# Altium schematic sheet FPGA_165B_Repeat_DigitalIO.SchDoc
size A; Organization: Altium Limited; Address1: L3, 12a Rodborough Rd; Address2: Frenchs Forest; Address3: NSW; Address4: Australia 2086; DocumentNumber: 1; SheetNumber: 1; SheetTotal: 2
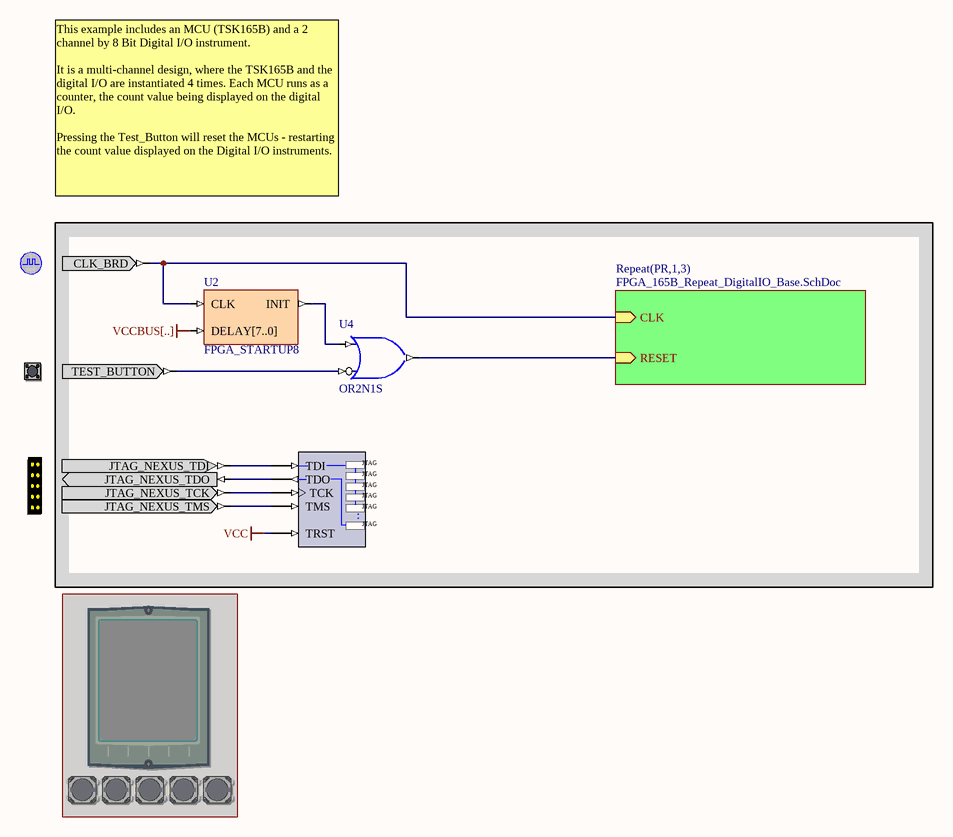
[diagram p0: FPGA_165B_Repeat_DigitalIO.SchDoc]

## Parts
(Parts that share a designator on the sheet are numbered #1, #2 ... from top to bottom, then left to right.)
?#1  CLOCK_BOARD  (value not drawn)
?#2  TEST_BUTTON  (value not drawn)
?#3  NEXUS_JTAG_CONNECTOR  (value not drawn)
?#4  FIRMWARE_TFT_ENABLE  (value not drawn)  (masked out: inside a compile mask, not in the netlist)
?#5  FIRMWARE_BUTTONS_ENABLE  (value not drawn)  (masked out: inside a compile mask, not in the netlist)
NEXUS_JTAG_PORT  NEXUS_JTAG_PORT  (value not drawn)
U2  FPGA_STARTUP8
U4  OR2N1S

## Sub-sheets
Repeat(PR,1,3) = FPGA_165B_Repeat_DigitalIO_Base.SchDoc: CLK (in), RESET (in)

## Nets
VCC: NEXUS_JTAG_PORT.TRST
VCCBUS[..]: U2.DELAY[7..0]
Net?#1_CLK_BRD: ?#1.CLK_BRD U2.CLK ; sheet Repeat(PR,1,3)/CLK
Net?#2_TEST_BUTTON: ?#2.TEST_BUTTON U4.I0
Net?#3_JTAG_NEXUS_TCK: ?#3.JTAG_NEXUS_TCK NEXUS_JTAG_PORT.TCK
Net?#3_JTAG_NEXUS_TDI: ?#3.JTAG_NEXUS_TDI NEXUS_JTAG_PORT.TDI
Net?#3_JTAG_NEXUS_TDO: ?#3.JTAG_NEXUS_TDO NEXUS_JTAG_PORT.TDO
Net?#3_JTAG_NEXUS_TMS: ?#3.JTAG_NEXUS_TMS NEXUS_JTAG_PORT.TMS
NetU2_INIT: U2.INIT U4.I1
NetU4_O: U4.O ; sheet Repeat(PR,1,3)/RESET

## Notes on the sheet
- This example includes an MCU (TSK165B) and a 2 channel by 8 Bit Digital I/O instrument.
  It is a multi-channel design, where the TSK165B and the digital I/O are instantiated 4 times. Each MCU runs as a counter, the count value being displayed on the digital I/O.
  Pressing the Test_Button will reset the MCUs - restarting the count value displayed on the Digital I/O instruments.
- Title
- Size:
- Date:
- A
- Number:
- Time:
- Revision:
- Sheet
- of
- File:
- (in symbol NEXUS_JTAG_PORT) JTAG; .

## Library data of the parts
?#1 = CLOCK_BOARD: Global System Clock Supply; PortComponent: True; Published: 19-Nov-2003; Publisher: Altium Limited; HelpURL: TR0143 Technical Reference Manual for Altium's Desktop NanoBoard NB2DSK01.pdf#page=41; UseInDSF: True
?#2 = TEST_BUTTON: Test / Reset Button; PortComponent: True; Published: 19-Nov-2003; Publisher: Altium Limited; HelpURL: TR0143 Technical Reference Manual for Altium's Desktop NanoBoard NB2DSK01.pdf#page=53
?#3 = NEXUS_JTAG_CONNECTOR: JTAG Port; PortComponent: True; Published: 19-Nov-2003; Publisher: Altium Limited; HelpURL: TR0102 NanoBoard Technical Reference Manual - NB1.pdf#page=33
?#4 = FIRMWARE_TFT_ENABLE: TFT LCD Panel; PortComponent: True; Published: 22-Jan-2007; Publisher: Altium Limited; HelpURL: TR0143 Technical Reference Manual for Altium's Desktop NanoBoard NB2DSK01.pdf#page=50
?#5 = FIRMWARE_BUTTONS_ENABLE: Generic User Buttons; PortComponent: True; Published: 16-Apr-2007; Publisher: Altium Limited; HelpURL: TR0143 Technical Reference Manual for Altium's Desktop NanoBoard NB2DSK01.pdf#page=53
NEXUS_JTAG_PORT = NEXUS_JTAG_PORT: Soft Nexus-Chain Connector; NEXUS_JTAG_CONNECTOR: True; Published: 18-Dec-2003; Publisher: Altium Limited
U2 = FPGA_STARTUP8: FPGA Startup With 8 Bit Delay; Published: 21/01/2004; Publisher: Altium Hobart Technology Centre; Core Revision: 1.00.00
U4 = OR2N1S: 2-Input OR Gate with Active Low A Input, Single Pin Version; Xilinx Equivalent: OR2B1; ArchiveName: GENERIC; Published: 18-Dec-2003; Publisher: Altium Limited; Core Revision: 1.00.00